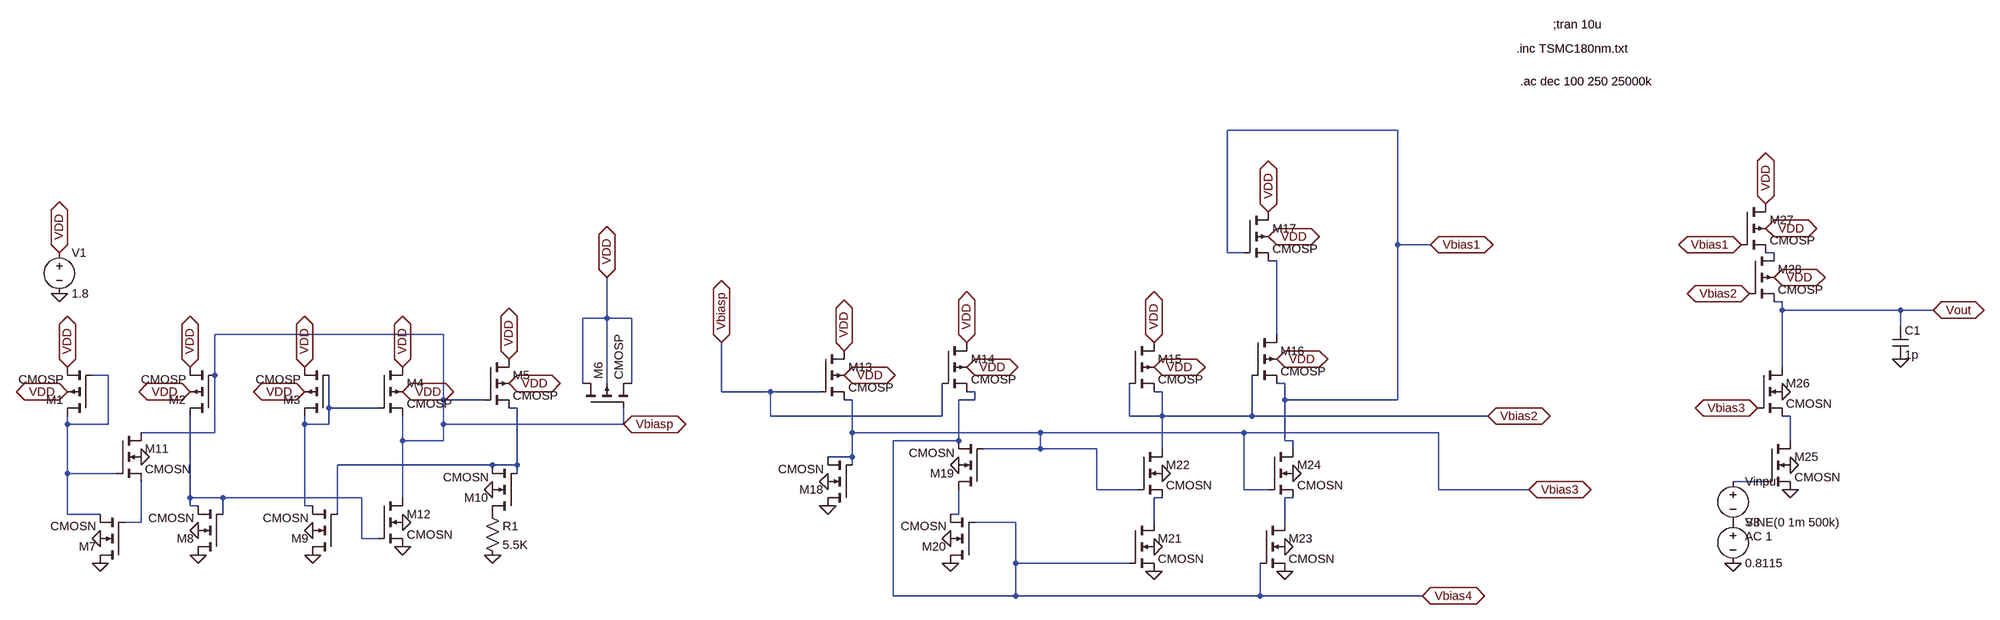
[diagram p0: schematic ckt_with_180nm.asc]
ckt_with_180nm.asc, the LTspice schematic file:
Version 4
SHEET 1 3712 680
WIRE 2512 -448 2032 -448
WIRE 2512 -224 2512 -448
WIRE 2576 -224 2512 -224
WIRE 2032 -208 2032 -448
WIRE 2064 -208 2032 -208
WIRE 3248 -208 3232 -208
WIRE 2128 -192 2112 -192
WIRE 3264 -112 3248 -112
WIRE 3264 -96 3264 -112
WIRE 3536 -96 3264 -96
WIRE 3600 -96 3536 -96
WIRE 816 -80 816 -160
WIRE 816 -80 768 -80
WIRE 864 -80 816 -80
WIRE 3536 -64 3536 -96
WIRE 496 -48 48 -48
WIRE 2128 -48 2128 -192
WIRE 3264 16 3264 -96
WIRE -160 32 -192 32
WIRE 48 32 48 -48
WIRE 768 48 768 -80
WIRE 816 48 816 -80
WIRE 864 48 864 -80
WIRE 2144 48 2128 48
WIRE 1040 64 1040 -32
WIRE 1136 64 1040 64
WIRE 1232 64 1136 64
WIRE 1536 64 1520 64
WIRE 1904 64 1888 64
WIRE 496 80 496 -48
WIRE 576 80 496 80
WIRE 1296 80 1280 80
WIRE 1536 80 1536 64
WIRE 1536 80 1504 80
WIRE 2144 80 2144 48
WIRE 2512 80 2512 -224
WIRE 2512 80 2144 80
WIRE 272 96 272 32
WIRE 368 96 272 96
WIRE 640 96 624 96
WIRE 1136 112 1136 64
WIRE 1472 112 1472 48
WIRE 1472 112 1136 112
WIRE 1840 112 1840 48
WIRE 1904 112 1904 64
WIRE 1904 112 1840 112
WIRE 2080 112 2080 32
WIRE 2080 112 1904 112
WIRE 2688 112 2080 112
WIRE 3280 112 3264 112
WIRE -240 128 -240 112
WIRE -160 128 -160 32
WIRE -160 128 -240 128
WIRE 224 128 224 112
WIRE 272 128 272 96
WIRE 272 128 224 128
WIRE 496 128 496 80
WIRE 848 128 848 96
WIRE 848 128 496 128
WIRE 48 144 48 32
WIRE 48 144 -96 144
WIRE 1296 144 1296 80
WIRE 1664 144 1296 144
WIRE 2064 144 1664 144
WIRE 2592 144 2064 144
WIRE 416 160 416 112
WIRE 496 160 496 128
WIRE 496 160 416 160
WIRE 1504 160 1504 80
WIRE 1504 160 1376 160
WIRE 2144 160 2144 80
WIRE 2160 160 2144 160
WIRE 3280 160 3280 112
WIRE 1664 176 1664 144
WIRE 1664 176 1552 176
WIRE 1776 176 1664 176
WIRE 1904 176 1904 112
WIRE 2160 176 2160 160
WIRE 1296 192 1296 144
WIRE 1296 192 1248 192
WIRE 592 208 288 208
WIRE 640 208 640 96
WIRE 640 208 592 208
WIRE 1296 208 1296 192
WIRE -240 224 -240 128
WIRE -144 224 -240 224
WIRE 640 224 640 208
WIRE 3232 240 3168 240
WIRE 1776 256 1776 176
WIRE 1856 256 1776 256
WIRE 2064 256 2064 144
WIRE 2112 256 2064 256
WIRE 2592 256 2592 144
WIRE 2768 256 2592 256
WIRE 0 272 0 112
WIRE 64 272 0 272
WIRE 336 272 64 272
WIRE 416 272 416 160
WIRE 1904 272 1888 272
WIRE 2160 272 2144 272
WIRE 0 288 0 272
WIRE 16 288 0 288
WIRE 224 288 224 128
WIRE 240 288 224 288
WIRE -240 304 -240 224
WIRE -176 304 -240 304
WIRE 64 304 64 272
WIRE 288 304 288 208
WIRE 1504 304 1504 256
WIRE 1504 304 1488 304
WIRE -96 320 -96 240
WIRE -96 320 -128 320
WIRE 1616 320 1536 320
WIRE 1888 320 1888 272
WIRE 2144 320 2144 272
WIRE 336 352 336 272
WIRE 368 352 336 352
WIRE 1616 400 1616 320
WIRE 1840 400 1616 400
WIRE 1376 464 1376 160
WIRE 1616 464 1616 400
WIRE 1616 464 1376 464
WIRE 2096 464 2096 400
WIRE 2096 464 1616 464
WIRE 2560 464 2096 464
FLAG -256 -128 0
FLAG -256 -208 VDD
IOPIN -256 -208 BiDir
FLAG 848 128 Vbiasp
IOPIN 848 128 BiDir
FLAG 1040 -32 Vbiasp
IOPIN 1040 -32 BiDir
FLAG -240 16 VDD
IOPIN -240 16 BiDir
FLAG -240 64 VDD
IOPIN -240 64 BiDir
FLAG 0 16 VDD
IOPIN 0 16 BiDir
FLAG 0 64 VDD
IOPIN 0 64 BiDir
FLAG 224 64 VDD
IOPIN 224 64 BiDir
FLAG 224 16 VDD
IOPIN 224 16 BiDir
FLAG 416 16 VDD
IOPIN 416 16 BiDir
FLAG 416 64 VDD
IOPIN 416 64 BiDir
FLAG 624 0 VDD
IOPIN 624 0 BiDir
FLAG 624 48 VDD
IOPIN 624 48 BiDir
FLAG 816 -160 VDD
IOPIN 816 -160 BiDir
FLAG 1280 -16 VDD
IOPIN 1280 -16 BiDir
FLAG 1280 32 VDD
IOPIN 1280 32 BiDir
FLAG 1520 -32 VDD
IOPIN 1520 -32 BiDir
FLAG 1520 16 VDD
IOPIN 1520 16 BiDir
FLAG 1888 -32 VDD
IOPIN 1888 -32 BiDir
FLAG 1888 16 VDD
IOPIN 1888 16 BiDir
FLAG 2128 0 VDD
IOPIN 2128 0 BiDir
FLAG 2112 -288 VDD
IOPIN 2112 -288 BiDir
FLAG 2112 -240 VDD
IOPIN 2112 -240 BiDir
FLAG -176 352 0
FLAG -176 400 0
FLAG -96 192 0
FLAG 16 336 0
FLAG 16 384 0
FLAG 240 336 0
FLAG 240 384 0
FLAG 416 320 0
FLAG 416 368 0
FLAG 592 256 0
FLAG 592 384 0
FLAG 1248 240 0
FLAG 1248 288 0
FLAG 1504 208 0
FLAG 1488 352 0
FLAG 1488 400 0
FLAG 1888 368 0
FLAG 1904 224 0
FLAG 1888 416 0
FLAG 2144 368 0
FLAG 2160 224 0
FLAG 2144 416 0
FLAG 2576 -224 Vbias1
IOPIN 2576 -224 BiDir
FLAG 2688 112 Vbias2
IOPIN 2688 112 BiDir
FLAG 2768 256 Vbias3
IOPIN 2768 256 BiDir
FLAG 2560 464 Vbias4
IOPIN 2560 464 BiDir
FLAG 3280 208 0
FLAG 3280 256 0
FLAG 3264 64 0
FLAG 3232 -304 VDD
IOPIN 3232 -304 BiDir
FLAG 3232 -256 VDD
IOPIN 3232 -256 BiDir
FLAG 3248 -160 VDD
IOPIN 3248 -160 BiDir
FLAG 3536 0 0
FLAG 3600 -96 Vout
IOPIN 3600 -96 BiDir
FLAG 3184 -224 Vbias1
IOPIN 3184 -224 BiDir
FLAG 3200 -128 Vbias2
IOPIN 3200 -128 BiDir
FLAG 3216 96 Vbias3
IOPIN 3216 96 BiDir
FLAG 3168 400 0
SYMBOL voltage -256 -224 R0
WINDOW 123 0 0 Left 0
WINDOW 39 0 0 Left 0
SYMATTR InstName V1
SYMATTR Value 1.8
SYMBOL pmos4 -192 112 R180
SYMATTR InstName M1
SYMATTR Value CMOSP
SYMATTR Value2 l=3.6u w=1.8u
SYMBOL pmos4 48 112 R180
SYMATTR InstName M2
SYMATTR Value CMOSP
SYMATTR Value2 l=0.36u w=4.32u
SYMBOL pmos4 272 112 R180
SYMATTR InstName M3
SYMATTR Value CMOSP
SYMATTR Value2 l=0.36u w=4.32u
SYMBOL pmos4 368 16 R0
SYMATTR InstName M4
SYMATTR Value CMOSP
SYMATTR Value2 l=0.36u w=4.32u
SYMBOL pmos4 576 0 R0
SYMATTR InstName M5
SYMATTR Value CMOSP
SYMATTR Value2 l=0.36u w=4.32u
SYMBOL pmos4 768 96 R270
SYMATTR InstName M6
SYMATTR Value CMOSP
SYMATTR Value2 l=9u w=9u
SYMBOL nmos4 -128 400 R180
SYMATTR InstName M7
SYMATTR Value CMOSN
SYMATTR Value2 l=0.36u w=1.8u
SYMBOL nmos4 64 384 R180
SYMATTR InstName M8
SYMATTR Value CMOSN
SYMATTR Value2 l=0.36u w=1.8u
SYMBOL nmos4 288 384 R180
SYMATTR InstName M9
SYMATTR Value CMOSN
SYMATTR Value2 l=0.36u w=1.8u
SYMBOL nmos4 640 304 R180
SYMATTR InstName M10
SYMATTR Value CMOSN
SYMATTR Value2 l=0.36u w=5.4u
SYMBOL nmos4 -144 144 R0
SYMATTR InstName M11
SYMATTR Value CMOSN
SYMATTR Value2 l=0.36u w=0.72u
SYMBOL nmos4 368 272 R0
SYMATTR InstName M12
SYMATTR Value CMOSN
SYMATTR Value2 l=0.36u w=1.8u
SYMBOL pmos4 1232 -16 R0
SYMATTR InstName M13
SYMATTR Value CMOSP
SYMATTR Value2 l=0.36u w=4.32u
SYMBOL pmos4 1472 -32 R0
SYMATTR InstName M14
SYMATTR Value CMOSP
SYMATTR Value2 l=0.36u w=4.32u
SYMBOL pmos4 1840 -32 R0
SYMATTR InstName M15
SYMATTR Value CMOSP
SYMATTR Value2 l=2.2u w=1.095u
SYMBOL pmos4 2080 -48 R0
SYMATTR InstName M16
SYMATTR Value CMOSP
SYMATTR Value2 l=1.8u w=3.24u
SYMBOL pmos4 2064 -288 R0
SYMATTR InstName M17
SYMATTR Value CMOSP
SYMATTR Value2 l=3.6u w=6.48u
SYMBOL res 576 288 R0
SYMATTR InstName R1
SYMATTR Value 5.5K
SYMBOL nmos4 1296 288 R180
SYMATTR InstName M18
SYMATTR Value CMOSN
SYMATTR Value2 l=3.06u w=0.27u
SYMBOL nmos4 1552 256 R180
SYMATTR InstName M19
SYMATTR Value CMOSN
SYMATTR Value2 l=0.36u w=1.8u
SYMBOL nmos4 1536 400 R180
SYMATTR InstName M20
SYMATTR Value CMOSN
SYMATTR Value2 l=0.36u w=1.8u
SYMBOL nmos4 1840 320 R0
SYMATTR InstName M21
SYMATTR Value CMOSN
SYMATTR Value2 l=0.36u w=1.8u
SYMBOL nmos4 1856 176 R0
SYMATTR InstName M22
SYMATTR Value CMOSN
SYMATTR Value2 l=0.36u w=1.8u
SYMBOL nmos4 2096 320 R0
SYMATTR InstName M23
SYMATTR Value CMOSN
SYMATTR Value2 l=0.36u w=1.8u
SYMBOL nmos4 2112 176 R0
SYMATTR InstName M24
SYMATTR Value CMOSN
SYMATTR Value2 l=0.72u w=3.6u
SYMBOL nmos4 3232 160 R0
SYMATTR InstName M25
SYMATTR Value CMOSN
SYMATTR Value2 l=0.36u w=2.16u
SYMBOL nmos4 3216 16 R0
SYMATTR InstName M26
SYMATTR Value CMOSN
SYMATTR Value2 l=0.36u w=2.16u
SYMBOL pmos4 3184 -304 R0
SYMATTR InstName M27
SYMATTR Value CMOSP
SYMATTR Value2 l=0.36u w=8.64u
SYMBOL pmos4 3200 -208 R0
SYMATTR InstName M28
SYMATTR Value CMOSP
SYMATTR Value2 l=0.635u w=8.64u
SYMBOL cap 3520 -64 R0
SYMATTR InstName C1
SYMATTR Value 1p
SYMBOL voltage 3168 224 R0
WINDOW 123 24 124 Left 2
WINDOW 39 0 0 Left 0
SYMATTR Value2 AC 1
SYMATTR InstName Vinput
SYMATTR Value SINE(0 1m 500k)
SYMBOL voltage 3168 304 R0
WINDOW 123 0 0 Left 0
WINDOW 39 0 0 Left 0
SYMATTR InstName V3
SYMATTR Value 0.8115
TEXT 2744 -608 Left 2 !.inc TSMC180nm.txt
TEXT 2816 -656 Left 2 !;tran 10u
TEXT 2752 -544 Left 2 !.ac dec 100 250 25000k

The netlist it stands for:
* ckt_with_180nm.asc
V1 VDD 0 1.8
M1 N003 N003 VDD VDD CMOSP l=3.6u w=1.8u
M2 N008 Vbiasp VDD VDD CMOSP l=0.36u w=4.32u
M3 N004 N004 VDD VDD CMOSP l=0.36u w=4.32u
M4 VDD N004 Vbiasp VDD CMOSP l=0.36u w=4.32u
M5 VDD Vbiasp N005 VDD CMOSP l=0.36u w=4.32u
M6 VDD Vbiasp VDD VDD CMOSP l=9u w=9u
M7 0 N012 N003 0 CMOSN l=0.36u w=1.8u
M8 0 N008 N008 0 CMOSN l=0.36u w=1.8u
M9 0 N005 N004 0 CMOSN l=0.36u w=1.8u
M10 P001 N005 N005 0 CMOSN l=0.36u w=5.4u
M11 Vbiasp N003 N012 0 CMOSN l=0.36u w=0.72u
M12 Vbiasp N008 0 0 CMOSN l=0.36u w=1.8u
M13 VDD Vbiasp Vbias3 VDD CMOSP l=0.36u w=4.32u
M14 VDD Vbiasp Vbias4 VDD CMOSP l=0.36u w=4.32u
M15 VDD Vbias2 Vbias2 VDD CMOSP l=2.2u w=1.095u
M16 N002 Vbias2 Vbias1 VDD CMOSP l=1.8u w=3.24u
M17 VDD Vbias1 N002 VDD CMOSP l=3.6u w=6.48u
R1 P001 0 5.5K
M18 0 Vbias3 Vbias3 0 CMOSN l=3.06u w=0.27u
M19 N011 Vbias3 Vbias4 0 CMOSN l=0.36u w=1.8u
M20 0 Vbias4 N011 0 CMOSN l=0.36u w=1.8u
M21 N009 Vbias4 0 0 CMOSN l=0.36u w=1.8u
M22 Vbias2 Vbias3 N009 0 CMOSN l=0.36u w=1.8u
M23 N010 Vbias4 0 0 CMOSN l=0.36u w=1.8u
M24 Vbias1 Vbias3 N010 0 CMOSN l=0.72u w=3.6u
M25 N006 N007 0 0 CMOSN l=0.36u w=2.16u
M26 Vout Vbias3 N006 0 CMOSN l=0.36u w=2.16u
M27 VDD Vbias1 N001 VDD CMOSP l=0.36u w=8.64u
M28 N001 Vbias2 Vout VDD CMOSP l=0.635u w=8.64u
C1 Vout 0 1p
Vinput N007 P002 SINE(0 1m 500k) AC 1
V3 P002 0 0.8115
.model NMOS NMOS
.model PMOS PMOS
.lib standard.mos
.inc TSMC180nm.txt
;tran 10u
.ac dec 100 250 25000k
.backanno
.end